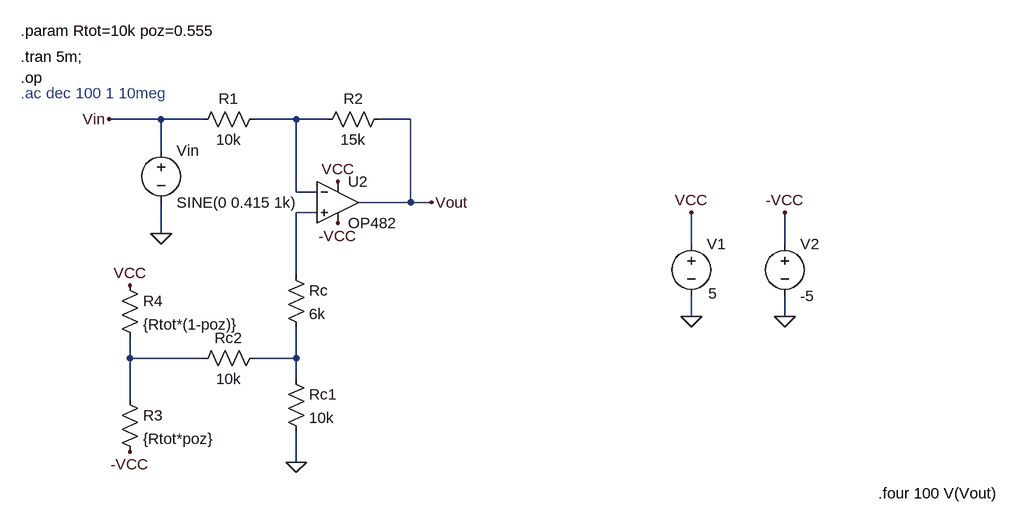
[diagram p0: schematic Etaj1_proiectScia.asc]
Etaj1_proiectScia.asc, the LTspice schematic file:
Version 4
SHEET 1 1224 760
WIRE -80 160 -160 160
WIRE -16 160 -80 160
WIRE 128 160 64 160
WIRE 176 160 128 160
WIRE 304 160 256 160
WIRE -80 208 -80 160
WIRE 128 272 128 160
WIRE 160 272 128 272
WIRE 304 288 304 160
WIRE 304 288 224 288
WIRE 336 288 304 288
WIRE 160 304 128 304
WIRE -80 336 -80 288
WIRE 736 352 736 304
WIRE 880 352 880 304
WIRE 128 400 128 304
WIRE 736 464 736 432
WIRE 880 464 880 432
WIRE -128 528 -128 496
WIRE -16 528 -128 528
WIRE 128 528 128 480
WIRE 128 528 64 528
WIRE 128 560 128 528
WIRE -128 592 -128 528
WIRE 128 688 128 640
FLAG 736 464 0
FLAG 880 464 0
FLAG 736 304 VCC
FLAG 192 256 VCC
FLAG 880 304 -VCC
FLAG 192 320 -VCC
FLAG -80 336 0
FLAG 128 688 0
FLAG -128 416 VCC
FLAG -128 672 -VCC
FLAG 336 288 Vout
FLAG -160 160 Vin
SYMBOL voltage 736 336 R0
WINDOW 3 26 92 Left 2
SYMATTR Value 5
SYMATTR InstName V1
SYMBOL voltage 880 336 R0
SYMATTR InstName V2
SYMATTR Value -5
SYMBOL Res 80 144 R90
WINDOW 0 0 56 VBottom 2
WINDOW 3 32 56 VTop 2
SYMATTR InstName R1
SYMATTR Value 10k
SYMBOL Res 272 144 R90
WINDOW 0 0 56 VBottom 2
WINDOW 3 32 56 VTop 2
SYMATTR InstName R2
SYMATTR Value 15k
SYMBOL Voltage -80 192 R0
SYMATTR InstName Vin
SYMATTR Value SINE(0 0.415 1k)
SYMATTR Value2 AC 1
SYMBOL Res 112 384 R0
SYMATTR InstName Rc
SYMATTR Value 6k
SYMBOL Res 112 544 R0
SYMATTR InstName Rc1
SYMATTR Value 10k
SYMBOL Res 80 512 R90
WINDOW 0 0 56 VBottom 2
WINDOW 3 32 56 VTop 2
SYMATTR InstName Rc2
SYMATTR Value 10k
SYMBOL Res -144 576 R0
SYMATTR InstName R3
SYMATTR Value {Rtot*poz}
SYMBOL Res -144 400 R0
SYMATTR InstName R4
SYMATTR Value {Rtot*(1-poz)}
SYMBOL OP482 192 224 R0
SYMATTR InstName U2
TEXT -296 24 Left 2 !.param Rtot=10k poz=0.555
TEXT -296 64 Left 2 !.tran 5m;
TEXT -296 96 Left 2 !.op
TEXT -296 120 Left 2 ;.ac dec 100 1 10meg
TEXT 1024 736 Left 2 !.four 100 V(Vout)

The netlist it stands for:
* Etaj1_proiectScia.asc
V1 VCC 0 5
V2 -VCC 0 -5
R1 N001 Vin 10k
R2 Vout N001 15k
Vin Vin 0 SINE(0 0.415 1k) AC 1
Rc N002 N004 6k
Rc1 N004 0 10k
Rc2 N004 N003 10k
R3 N003 -VCC {Rtot*poz}
R4 VCC N003 {Rtot*(1-poz)}
* U2: OP482 (symbol OP482 not available, pins judged from their places): In+=N002 In-=N001 V+=VCC V-=-VCC OUT=Vout
.param Rtot=10k poz=0.555
.tran 5m;
.op
* .ac dec 100 1 10meg
.four 100 V(Vout)
.backanno
.end